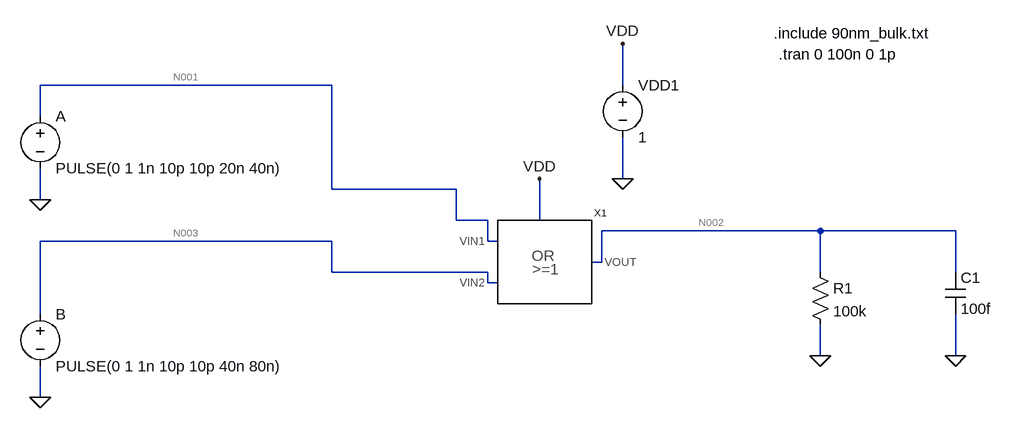
[diagram p0: schematic or_main.asc]
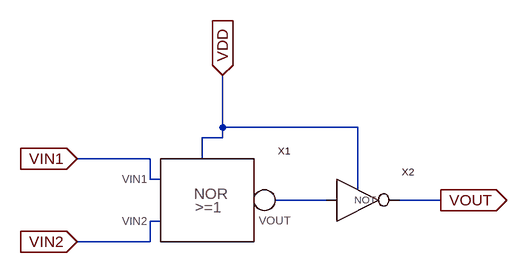
[diagram p1: sub-circuit or.asc]
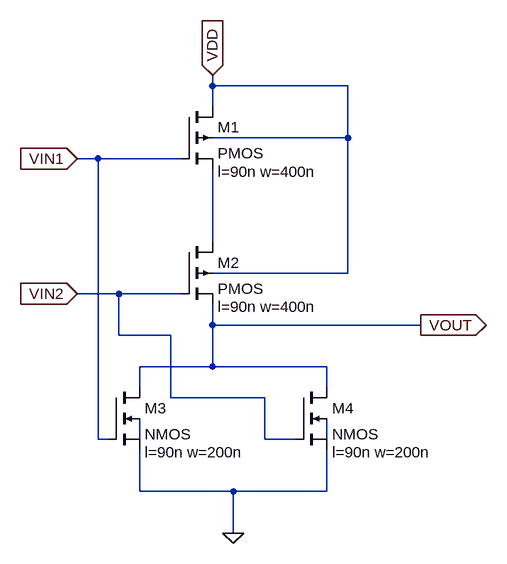
[diagram p2: sub-circuit nor.asc]
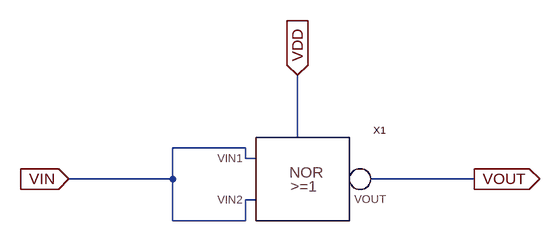
[diagram p3: sub-circuit not.asc]
or_main.asc, the LTspice schematic file:
Version 4
SHEET 1 1332 852
WIRE 304 -16 -144 -16
WIRE 752 -16 752 -80
WIRE -144 32 -144 -16
WIRE 752 128 752 64
WIRE 304 144 304 -16
WIRE 496 144 304 144
WIRE -144 160 -144 112
WIRE 496 192 496 144
WIRE 544 192 496 192
WIRE 624 192 624 128
WIRE 1056 208 720 208
WIRE 1264 208 1056 208
WIRE 304 224 -144 224
WIRE 544 224 544 192
WIRE 560 224 544 224
WIRE 720 256 720 208
WIRE 720 256 704 256
WIRE 304 272 304 224
WIRE 544 272 304 272
WIRE 1056 272 1056 208
WIRE 1264 272 1264 208
WIRE 544 288 544 272
WIRE 560 288 544 288
WIRE -144 336 -144 224
WIRE 1056 400 1056 352
WIRE 1264 400 1264 336
WIRE -144 464 -144 416
FLAG -144 160 0
FLAG -144 464 0
FLAG 752 128 0
FLAG 752 -80 VDD
FLAG 624 128 VDD
FLAG 1056 400 0
FLAG 1264 400 0
SYMBOL voltage -144 16 R0
WINDOW 123 0 0 Left 0
WINDOW 39 0 0 Left 0
SYMATTR InstName A
SYMATTR Value PULSE(0 1 1n 10p 10p 20n 40n)
SYMBOL voltage -144 320 R0
WINDOW 123 0 0 Left 0
WINDOW 39 0 0 Left 0
SYMATTR InstName B
SYMATTR Value PULSE(0 1 1n 10p 10p 40n 80n)
SYMBOL voltage 752 -32 R0
WINDOW 123 0 0 Left 0
WINDOW 39 0 0 Left 0
SYMATTR InstName VDD1
SYMATTR Value 1
SYMBOL res 1040 256 R0
SYMATTR InstName R1
SYMATTR Value 100k
SYMBOL cap 1248 272 R0
SYMATTR InstName C1
SYMATTR Value 100f
SYMBOL or 544 224 R0
SYMATTR InstName X1
TEXT 984 -96 Left 2 !.include 90nm_bulk.txt
TEXT 992 -64 Left 2 !.tran 0 100n 0 1p

or.asc, the sub-circuit schematic file:
Version 4
SHEET 1 880 680
WIRE 288 80 288 0
WIRE 496 80 288 80
WIRE 288 96 288 80
WIRE 288 96 256 96
WIRE 176 128 64 128
WIRE 256 128 256 96
WIRE 176 160 176 128
WIRE 192 160 176 160
WIRE 496 176 496 80
WIRE 464 192 368 192
WIRE 624 192 544 192
WIRE 192 224 176 224
WIRE 176 256 176 224
WIRE 176 256 64 256
FLAG 64 128 VIN1
IOPIN 64 128 In
FLAG 64 256 VIN2
IOPIN 64 256 In
FLAG 624 192 VOUT
IOPIN 624 192 Out
FLAG 288 0 VDD
IOPIN 288 0 In
SYMBOL nor 176 160 R0
SYMATTR InstName X1
SYMBOL not 480 192 R0
SYMATTR InstName X2

nor.asc, the sub-circuit schematic file:
Version 4
SHEET 1 880 680
WIRE -32 -64 -32 -80
WIRE 176 -64 -32 -64
WIRE -32 -32 -32 -64
WIRE 176 16 176 -64
WIRE 176 16 -32 16
WIRE -208 48 -240 48
WIRE -80 48 -208 48
WIRE -32 176 -32 64
WIRE 176 224 176 16
WIRE 176 224 -32 224
WIRE -176 256 -240 256
WIRE -80 256 -176 256
WIRE -32 304 -32 272
WIRE 288 304 -32 304
WIRE -176 320 -176 256
WIRE -96 320 -176 320
WIRE -32 368 -32 304
WIRE -32 368 -144 368
WIRE 144 368 -32 368
WIRE -144 400 -144 368
WIRE 144 400 144 368
WIRE -96 416 -96 320
WIRE 48 416 -96 416
WIRE -208 480 -208 48
WIRE -192 480 -208 480
WIRE -144 480 -144 448
WIRE 48 480 48 416
WIRE 96 480 48 480
WIRE 144 480 144 448
WIRE -144 560 -144 496
WIRE 0 560 -144 560
WIRE 144 560 144 496
WIRE 144 560 0 560
WIRE 0 624 0 560
FLAG -32 -80 VDD
IOPIN -32 -80 In
FLAG -240 48 VIN1
IOPIN -240 48 In
FLAG -240 256 VIN2
IOPIN -240 256 In
FLAG 288 304 VOUT
IOPIN 288 304 Out
FLAG 0 624 0
SYMBOL pmos4 -80 -32 R0
WINDOW 123 56 100 Left 2
SYMATTR Value2 l=90n w=400n
SYMATTR InstName M1
SYMBOL pmos4 -80 176 R0
WINDOW 123 56 100 Left 2
SYMATTR Value2 l=90n w=400n
SYMATTR InstName M2
SYMBOL nmos4 -192 400 R0
WINDOW 123 56 100 Left 2
SYMATTR Value2 l=90n w=200n
SYMATTR InstName M3
SYMBOL nmos4 96 400 R0
WINDOW 123 56 100 Left 2
SYMATTR Value2 l=90n w=200n
SYMATTR InstName M4

not.asc, the sub-circuit schematic file:
Version 4
SHEET 1 880 680
WIRE 384 80 384 -16
WIRE 304 96 192 96
WIRE 304 112 304 96
WIRE 320 112 304 112
WIRE 192 144 192 96
WIRE 192 144 32 144
WIRE 656 144 496 144
WIRE 320 176 304 176
WIRE 192 208 192 144
WIRE 304 208 304 176
WIRE 304 208 192 208
FLAG 32 144 VIN
IOPIN 32 144 In
FLAG 384 -16 VDD
IOPIN 384 -16 In
FLAG 656 144 VOUT
IOPIN 656 144 Out
SYMBOL nor 304 112 R0
SYMATTR InstName X1

The netlist it stands for:
* or_main.asc
V§A N001 0 PULSE(0 1 1n 10p 10p 20n 40n)
V§B N003 0 PULSE(0 1 1n 10p 10p 40n 80n)
VDD1 VDD 0 1
R1 N002 0 100k
C1 N002 0 100f
XX1 N001 N003 N002 VDD or

* block symbol definitions
.subckt or VIN1 VIN2 VOUT VDD
XX1 VIN1 VIN2 N001 VDD nor
XX2 N001 VOUT VDD not
.ends or

.subckt nor VIN1 VIN2 VOUT VDD
M1 VDD VIN1 N001 VDD PMOS l=90n w=400n
M2 N001 VIN2 VOUT VDD PMOS l=90n w=400n
M3 VOUT VIN1 0 N002 NMOS l=90n w=200n
M4 VOUT VIN2 0 N003 NMOS l=90n w=200n
.ends nor

.subckt not VIN VOUT VDD
XX1 VIN VIN VOUT VDD nor
.ends not

.model NMOS NMOS
.model PMOS PMOS
.lib standard.mos
.include 90nm_bulk.txt
.tran 0 100n 0 1p
.backanno
.end

* Results of the author's LTspice run, read from the files saved beside the schematic
* Operating Point, zero values left out:
*   V(vdd) = 1 V
*   V(n002) = 664.3 nV
*   I(R1) = 6.643 pA
*   I(Vdd1) = -58.45 nA
*   I(B) = 130.6 pA
*   I(A) = 130.6 pA
*   Ix(x1:VIN1) = -130.6 pA
*   Ix(x1:VIN2) = -130.6 pA
*   Ix(x1:VOUT) = -6.65 pA
*   Ix(x1:VDD) = 58.45 nA
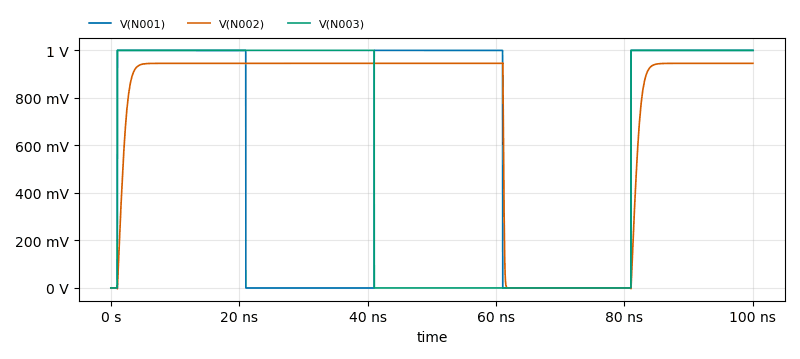
[diagram p4: Transient Analysis of or_main.asc, plotted from the saved traces]
* Transient Analysis, 1 run:
*   V(N001): min 0 V, max 1 V, average 590.1 mV, rms 768.2 mV, last 1 V
*   V(N002): min -3.603 mV, max 946.9 mV, average 730.5 mV, rms 826.4 mV, last 945.3 mV
*   V(N003): min 0 V, max 1 V, average 590 mV, rms 768.1 mV, last 1 V